# EAGLE schematic Task (EAGLE 8.2.1)
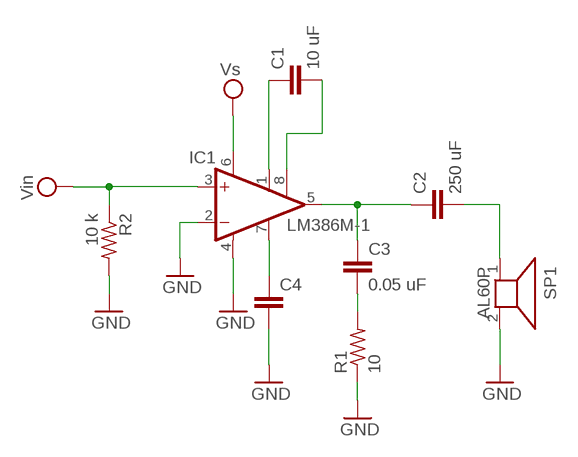
[diagram p0: schematic, sheet 1]

## Parts
C1  10 uF  C5/3  [C5B3]
C2  250 uF  C5/3  [C5B3]
C3  0.05 uF  C5/3  [C5B3]
C4  C5/3  [C5B3]
IC1  LM386M-1  [SO08]
R1  10  R-US_M0805  [M0805]
R2  10 k  R-US_M0805  [M0805]
SP1  AL60P  [AL60P]

## Nets
GND: C4.2 IC1.2(-IN) IC1.4(GND) R1.1 R2.2 SP1.2
N$1: C4.1 IC1.7(BYPASS)
N$2: C1.1 IC1.1(GAIN)
N$3: C1.2 IC1.8(GAIN)
N$4: C2.1 C3.1 IC1.5(OUT)
N$5: C3.2 R1.2
N$6: C2.2 SP1.1
VCC: IC1.3(+IN) IC1.6(VS) R2.1 ; supply symbol labelled Vs, Vin

## Library data of the parts
C1-C4 = capacitor-wima:C: CAPACITOR naming: grid - package width
IC1 = linear:LM386?-*: Low Voltage Audio Power Amplifier Source: http://cache.national.com/ds/LM/LM386.pdf
R1 R2 = resistor:R-US_: RESISTOR, American symbol
SP1 = buzzer:AL60P: SPEAKER Source: Buerklin; OC_FARNELL: unknown; OC_NEWARK: unknown